# Altium schematic sheet LED_16x_Schematic.SchDoc
size A4; DocumentNumber: 4; SheetNumber: 4; SheetTotal: 5
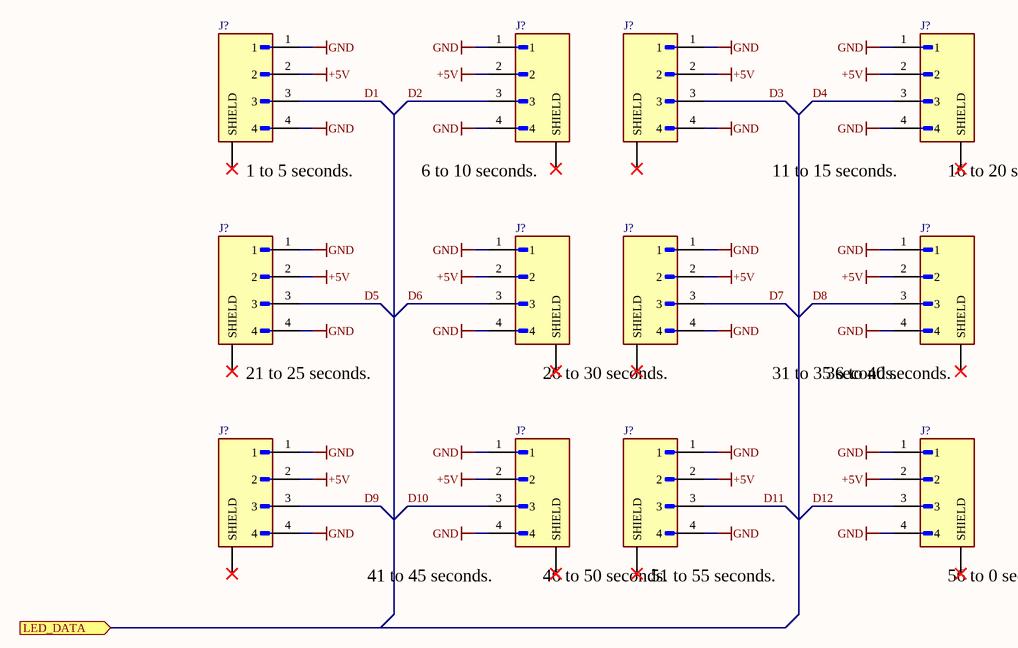
[diagram p0: LED_16x_Schematic.SchDoc]

## Parts
(Parts that share a designator on the sheet are numbered #1, #2 ... from top to bottom, then left to right.)
J?#1  B4B-PH-SM4-TB  [Connector_SMD]  (value not drawn)
J?#2  B4B-PH-SM4-TB  [Connector_SMD]  (value not drawn)
J?#3  B4B-PH-SM4-TB  [Connector_SMD]  (value not drawn)
J?#4  B4B-PH-SM4-TB  [Connector_SMD]  (value not drawn)
J?#5  B4B-PH-SM4-TB  [Connector_SMD]  (value not drawn)
J?#6  B4B-PH-SM4-TB  [Connector_SMD]  (value not drawn)
J?#7  B4B-PH-SM4-TB  [Connector_SMD]  (value not drawn)
J?#8  B4B-PH-SM4-TB  [Connector_SMD]  (value not drawn)
J?#9  B4B-PH-SM4-TB  [Connector_SMD]  (value not drawn)
J?#10  B4B-PH-SM4-TB  [Connector_SMD]  (value not drawn)
J?#11  B4B-PH-SM4-TB  [Connector_SMD]  (value not drawn)
J?#12  B4B-PH-SM4-TB  [Connector_SMD]  (value not drawn)

## Ports
LED_DATA (in)

## Nets
+5V: J?#1.2 J?#2.2 J?#3.2 J?#4.2 J?#5.2 J?#6.2 J?#7.2 J?#8.2 J?#9.2 J?#10.2 J?#11.2 J?#12.2
GND: J?#1.1 J?#1.4 J?#2.1 J?#2.4 J?#3.1 J?#3.4 J?#4.1 J?#4.4 J?#5.1 J?#5.4 J?#6.1 J?#6.4 J?#7.1 J?#7.4 J?#8.1 J?#8.4 J?#9.1 J?#9.4 J?#10.1 J?#10.4 J?#11.1 J?#11.4 J?#12.1 J?#12.4
D1: J?#1.3
D2: J?#3.3
D3: J?#2.3
D4: J?#4.3
D5: J?#5.3
D6: J?#7.3
D7: J?#6.3
D8: J?#8.3
D9: J?#9.3
D10: J?#11.3
D11: J?#10.3
D12: J?#12.3
NetJ?#1_SH1: J?#1.SH1(SHIELD) J?#1.SH2(SHIELD)
NetJ?#2_SH1: J?#2.SH1(SHIELD) J?#2.SH2(SHIELD)
NetJ?#3_SH1: J?#3.SH1(SHIELD) J?#3.SH2(SHIELD)
NetJ?#4_SH1: J?#4.SH1(SHIELD) J?#4.SH2(SHIELD)
NetJ?#5_SH1: J?#5.SH1(SHIELD) J?#5.SH2(SHIELD)
NetJ?#6_SH1: J?#6.SH1(SHIELD) J?#6.SH2(SHIELD)
NetJ?#7_SH1: J?#7.SH1(SHIELD) J?#7.SH2(SHIELD)
NetJ?#8_SH1: J?#8.SH1(SHIELD) J?#8.SH2(SHIELD)
NetJ?#9_SH1: J?#9.SH1(SHIELD) J?#9.SH2(SHIELD)
NetJ?#10_SH1: J?#10.SH1(SHIELD) J?#10.SH2(SHIELD)
NetJ?#11_SH1: J?#11.SH1(SHIELD) J?#11.SH2(SHIELD)
NetJ?#12_SH1: J?#12.SH1(SHIELD) J?#12.SH2(SHIELD)

## Notes on the sheet
- (near J?#1) 1 to 5 seconds.
- (near J?#3) 6 to 10 seconds.
- (near J?#2) 11 to 15 seconds.
- (near J?#4) 16 to 20 seconds.
- (near J?#5) 21 to 25 seconds.
- (near J?#7) 26 to 30 seconds.
- (near J?#6) 31 to 35 seconds.
- (near J?#8) 36 to 40 seconds.
- (near J?#9) 41 to 45 seconds.
- (near J?#11) 46 to 50 seconds.
- (near J?#10) 51 to 55 seconds.
- (near J?#12) 56 to 0 seconds.
- Date:
- Title of drawing:
- Time:
- Drawn by:
- Project:
- Revision:
- Institut:
- Departement:
- Page:
- from:
- File:

## Library data of the parts
J?#1-J?#12 = Connector_SMD: CONN HEADER SMD 4POS 2MM.; ComponentLink1Description: Supplier; ComponentLink1URL: https://www.digikey.ch/en/products/detail/jst-sales-america-inc/B4B-PH-SM4-TB/926643